# EAGLE design B-4-carte (EAGLE 9.6.2)
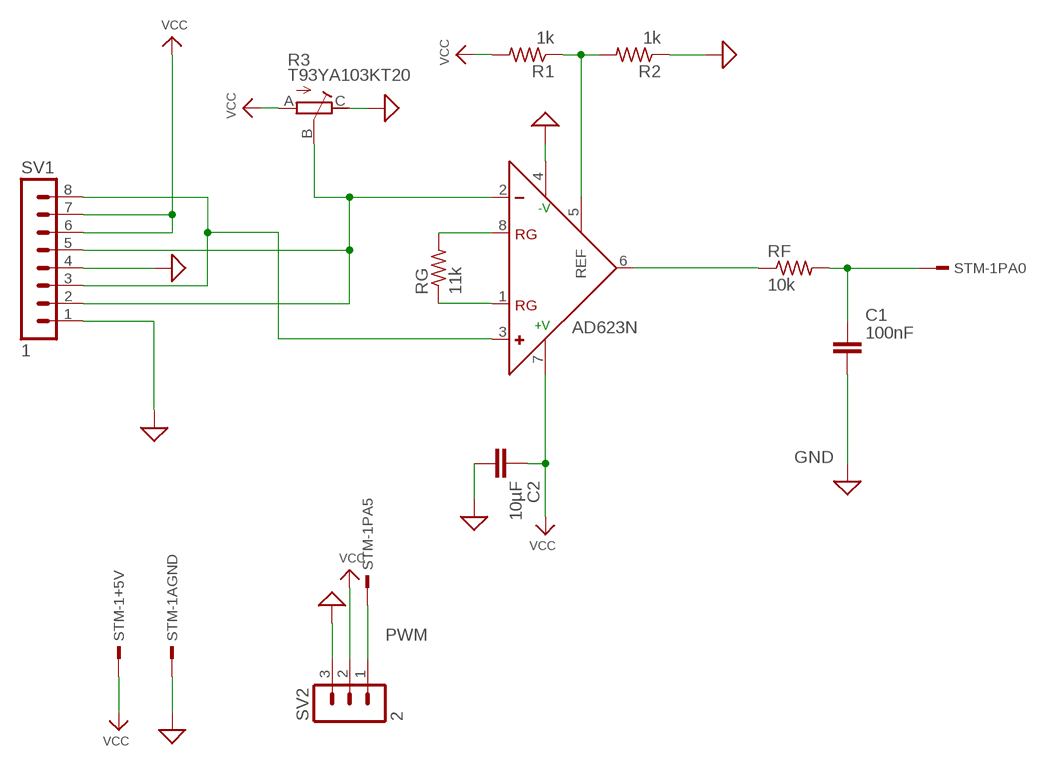
[diagram p0: schematic, sheet 1]

## Parts
C1  100nF  C2.5/2  [C2.5-2]
C2  10µF  C2.5/2  [C2.5-2]
IC1  AD623N  [DIL08]
R1  1k  R-US_0204/7  [0204/7]
R2  1k  R-US_0204/7  [0204/7]
R3  T93YA103KT20  [TRIM_T93YA103KT20]
RF  10k  R-US_0204/7  [0204/7]
RG  11k  R-US_0204/7  [0204/7]
STM-1  NUCLEO-F411RE  [CONN_STM32_NUCLEO]
SV1  1  MA08-1  [MA08-1]
SV2  2  MA03-1  [MA03-1]

## Nets
GND: C1.2 C2.2 IC1.4(-V) R2.1 R3.C STM-1.70 SV1.1 SV1.4 SV2.3 ; supply symbol labelled SUP
N$1: IC1.3(+) SV1.3 SV1.8
N$2: C1.1 RF.2 STM-1.28
N$3: IC1.2(-) R3.B SV1.2 SV1.5
N$6: IC1.1(RG) RG.1
N$7: IC1.8(RG) RG.2
N$10: IC1.5(REF) R1.1 R2.2
N$11: IC1.6(OUT) RF.1
PWM: STM-1.49 SV2.1
VCC: C2.1 IC1.7(+V) R1.2 R3.A STM-1.18 SV1.6 SV1.7 SV2.2
Unconnected: STM-1.1 STM-1.2 STM-1.3 STM-1.4 STM-1.5 STM-1.6 STM-1.7 STM-1.8 STM-1.9 STM-1.10 STM-1.11 STM-1.12 STM-1.13 STM-1.14 STM-1.15 STM-1.16 STM-1.17 STM-1.19 STM-1.20 STM-1.21 STM-1.22 STM-1.23 STM-1.24 STM-1.25 STM-1.26 STM-1.27 STM-1.29 STM-1.30 STM-1.31 STM-1.32 STM-1.33 STM-1.34 STM-1.35 STM-1.36 STM-1.37 STM-1.38 STM-1.39 STM-1.40 STM-1.41 STM-1.42 STM-1.43 STM-1.44 STM-1.45 STM-1.46 STM-1.47 STM-1.48 STM-1.50 STM-1.51 STM-1.52 STM-1.53 STM-1.54 STM-1.55 STM-1.56 STM-1.57 STM-1.58 STM-1.59 STM-1.60 STM-1.61 STM-1.62 STM-1.63 STM-1.64 STM-1.65 STM-1.66 STM-1.67 STM-1.68 STM-1.69 STM-1.71 STM-1.72 STM-1.73 STM-1.74 STM-1.75 STM-1.76

## Library data of the parts
C1 C2 = capacitor-wima:C: CAPACITOR naming: grid - package width
IC1 = analog-devices:AD623: Single-Supply, Rail-to-Rail, Low Cost Instrumentation Amplifier Source: http://www.analog.com/static/imported-files/data_sheets/AD623.pdf; MF: ALTERA CORPORATION; MPN: AD623ANZ; OC_FARNELL: 9603700; OC_NEWARK: 59K4402
R1 RG = adafruit:R-US_: RESISTOR, American symbol
R2 RF = BeagleBone_Black_Wireless:R-US_: RESISTOR, American symbol
R3 = T93YA103KT20:T93YA103KT20: Check availability <https://pricing.snapeda.com/parts/T93YA103KT20/Vishay/view-part?ref=eda>; AVAILABILITY: In Stock; CHECK_PRICES: https://www.snapeda.com/parts/T93YA103KT20/Vishay+Sfernice/view-part/?ref=eda; DESCRIPTION: 10 kOhms 0.5W, 1/2W PC Pins Through Hole Trimmer Potentiometer Cermet 21.0 Turn Top Adjustment; MF: Vishay; MP: T93YA103KT20; PACKAGE: TSOP-32338 Vishay; PRICE: None; SNAPEDA_LINK: https://www.snapeda.com/parts/T93YA103KT20/Vishay+Sfernice/view-part/?ref=snap
STM-1 = prj-ips-jmb:NUCLEO-F411RE
SV1 = con-lstb:MA08-1: PIN HEADER; OC_FARNELL: unknown; OC_NEWARK: unknown
SV2 = con-lstb:MA03-1: PIN HEADER; OC_FARNELL: unknown; OC_NEWARK: unknown

## Board
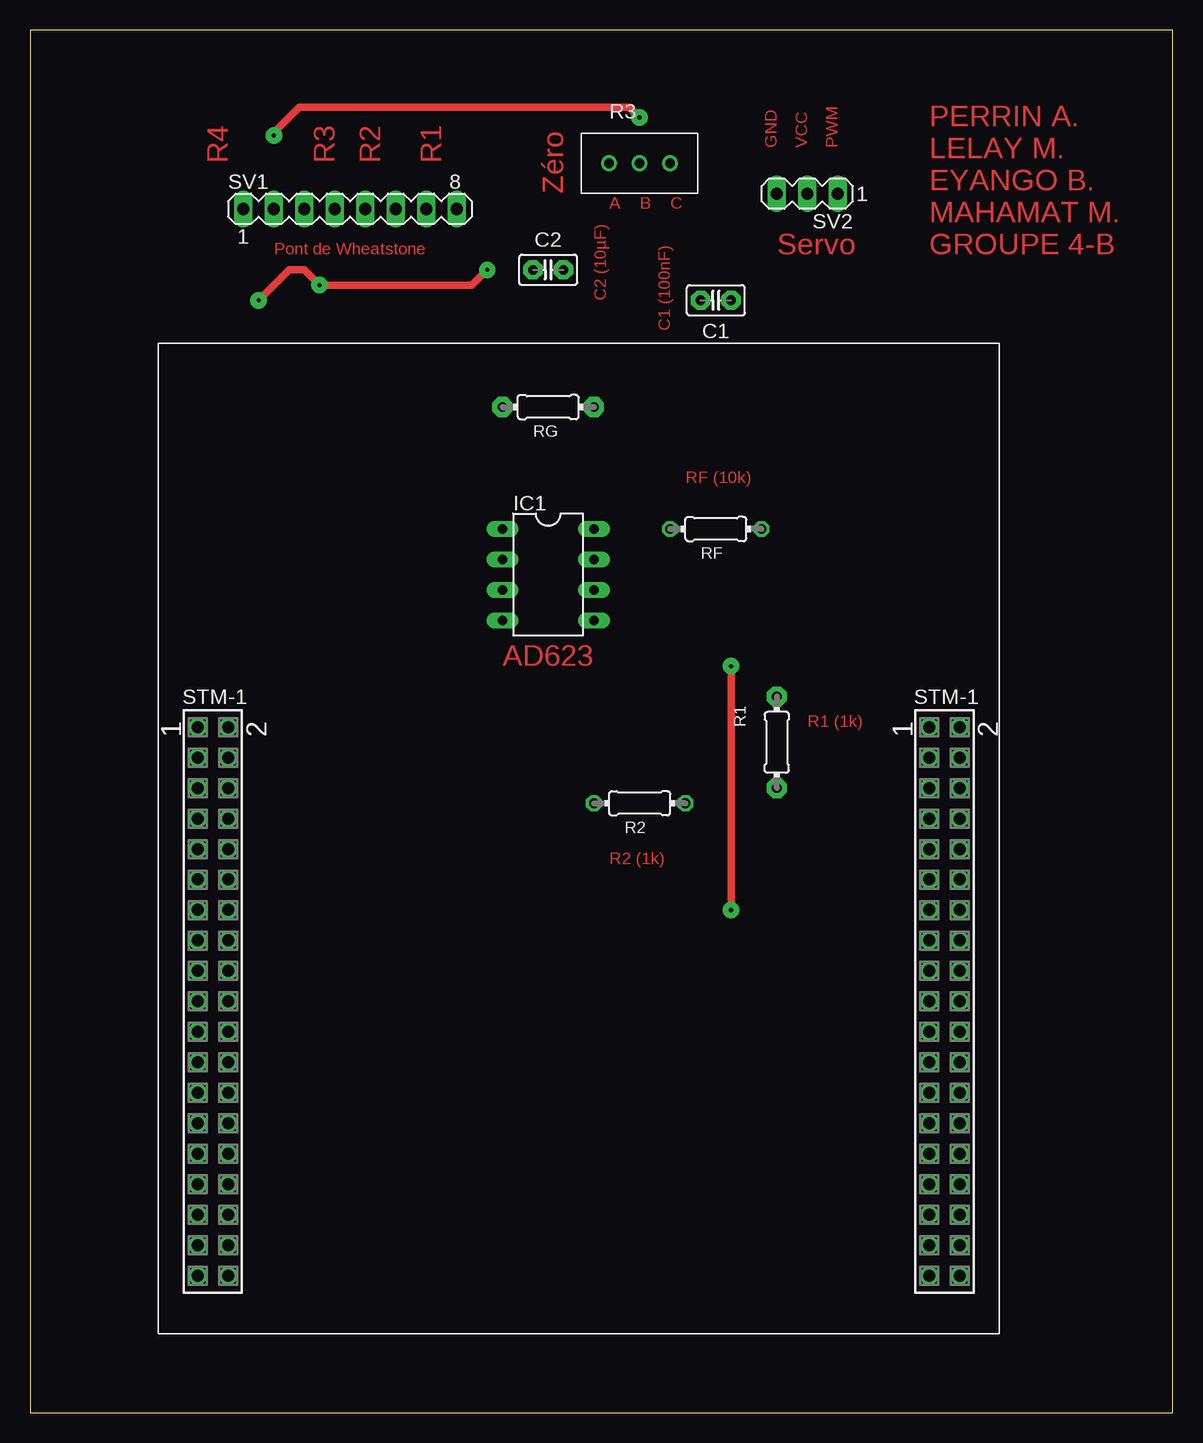
[diagram p1: board, top side]
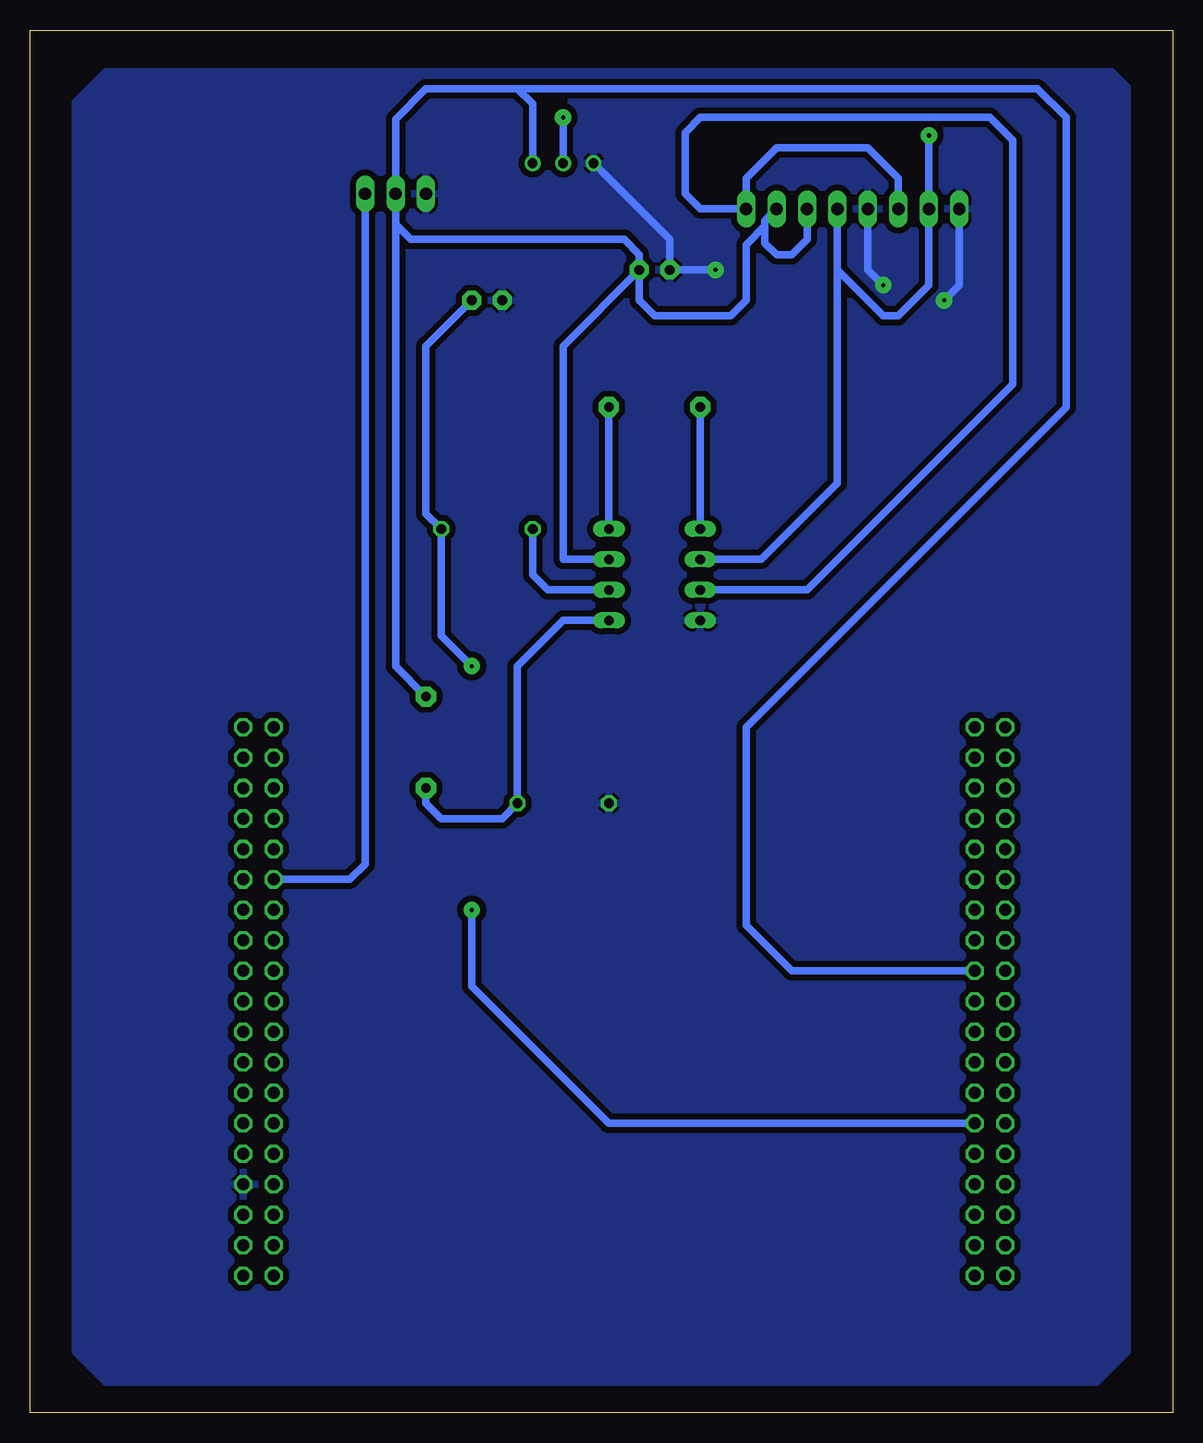
[diagram p2: board, bottom side, seen from below]

Size 95.23 x 115.24 mm. Coordinates in mm from the lower left corner, seen from the top.
Outline: 0,0 95.23,0 95.23,115.24 0,115.24 0,0
Copper layers (1*16): Top 0.035mm / dielectric 1.5mm / Bottom 0.035mm
Design rules "LBMS-ENIB": minimum track width 24mil, minimum drill 10mil, track to track 20mil, track to pad 20mil, pad to pad 20mil, via to via 20mil, smd to smd 8mil, copper to edge 80mil, drill to drill 8mil, minimum pad ring 10mil, minimum via ring 20mil, stop-mask expansion 4mil, vias tented up to drill 0mil, thermal gap 10mil

### Footprints (pad centres in the part's own frame; a part is rotated, then mirrored left to right if it is on the bottom)
C2.5-2 = drill 0.813 pad 1.6 octagon: 1 -1.27,0; 2 1.27,0
DIL08 = drill 0.813 long: 1 -3.81,-3.81; 2 -1.27,-3.81; 3 1.27,-3.81; 4 3.81,-3.81; 5 3.81,3.81; 6 1.27,3.81; 7 -1.27,3.81; 8 -3.81,3.81
0204/7 = drill 0.813 pad 1.676 octagon: 1 -3.81,0; 2 3.81,0
0204/7' = drill 0.813 octagon: 1 -3.81,0; 2 3.81,0
TRIM_T93YA103KT20 = drill 0.8: A 0,2.54; B 0,0; C 0,-2.54
CONN_STM32_NUCLEO = drill 1 pad 1.5 octagon: 1 -1.27,22.86; 2 1.27,22.86; 3 -1.27,20.32; 4 1.27,20.32; 5 -1.27,17.78; 6 1.27,17.78; 7 -1.27,15.24; 8 1.27,15.24; 9 -1.27,12.7; 10 1.27,12.7; 11 -1.27,10.16; 12 1.27,10.16; 13 -1.27,7.62; 14 1.27,7.62; 15 -1.27,5.08; 16 1.27,5.08; 17 -1.27,2.54; 18 1.27,2.54; 19 -1.27,0; 20 1.27,0; 21 -1.27,-2.54; 22 1.27,-2.54; 23 -1.27,-5.08; 24 1.27,-5.08; 25 -1.27,-7.62; 26 1.27,-7.62; 27 -1.27,-10.16; 28 1.27,-10.16; 29 -1.27,-12.7; 30 1.27,-12.7; 31 -1.27,-15.24; 32 1.27,-15.24; 33 -1.27,-17.78; 34 1.27,-17.78; 35 -1.27,-20.32; 36 1.27,-20.32; 37 -1.27,-22.86; 38 1.27,-22.86; 39 59.69,22.86; 40 62.23,22.86; 41 59.69,20.32; 42 62.23,20.32; 43 59.69,17.78; 44 62.23,17.78; 45 59.69,15.24; 46 62.23,15.24; 47 59.69,12.7; 48 62.23,12.7; 49 59.69,10.16; 50 62.23,10.16; 51 59.69,7.62; 52 62.23,7.62; 53 59.69,5.08; 54 62.23,5.08; 55 59.69,2.54; 56 62.23,2.54; 57 59.69,0; 58 62.23,0; 59 59.69,-2.54; 60 62.23,-2.54; 61 59.69,-5.08; 62 62.23,-5.08; 63 59.69,-7.62; 64 62.23,-7.62; 65 59.69,-10.16; 66 62.23,-10.16; 67 59.69,-12.7; 68 62.23,-12.7; 69 59.69,-15.24; 70 62.23,-15.24; 71 59.69,-17.78; 72 62.23,-17.78; 73 59.69,-20.32; 74 62.23,-20.32; 75 59.69,-22.86; 76 62.23,-22.86
MA08-1 = drill 1.016 long: 1 -8.89,0; 2 -6.35,0; 3 -3.81,0; 4 -1.27,0; 5 1.27,0; 6 3.81,0; 7 6.35,0; 8 8.89,0
MA03-1 = drill 1.016 long: 1 -2.54,0; 2 0,0; 3 2.54,0

### Placement (x,y rotation side)
C1  57.15,92.71 180 top
C2  43.18,95.25 180 top
IC1  43.18,69.85 270 top
R1  62.23,55.88 90 top
R2  1k  [0204/7']  50.8,50.8 0 top
R3  50.8,104.14 270 top
RF  10k  [0204/7']  57.15,73.66 0 top
RG  43.18,83.82 0 top
STM-1  15.24,34.29 0 top
SV1  26.67,100.33 0 top
SV2  64.77,101.6 180 top

### Tracks (layer width: path | path; a pad name or v marks a point on that pad's centre or on a via)
GND  (via drill 0.35)
  Top 0.61: v19.05,92.71 21.59,95.25 22.86,95.25 v24.13,93.98 36.83,93.98 v38.1,95.25
  Bottom 0.61: v38.1,95.25 C2.2 41.91,97.79 R3.C | SV1.1 17.78,93.98 v19.05,92.71 | v24.13,93.98 25.4,95.25 SV1.4
  pour Bottom: 5.08,111.76 88.9,111.76 91.44,109.22 91.44,5.08 88.9,2.54 6.35,2.54 3.81,5.08 3.81,110.49
N$1
  Bottom 0.61: SV1.3 22.86,102.87 25.4,105.41 33.02,105.41 35.56,102.87 SV1.8 39.37,100.33 40.64,101.6 40.64,106.68 39.37,107.95 15.24,107.95 13.34,106.05 13.34,85.73 30.48,68.58 IC1.3
N$2  (via drill 0.35)
  Top 0.61: v58.42,62.23 v58.42,41.91
  Bottom 0.61: C1.1 62.23,88.9 62.23,74.93 RF.2 60.96,64.77 v58.42,62.23 | STM-1.28 46.99,24.13 58.42,35.56 v58.42,41.91
N$3  (via drill 0.35)
  Top 0.61: v50.8,107.95 49.96,108.79 22.43,108.79 20.32,106.68 v20.32,106.45
  Bottom 0.61: IC1.2 34.29,71.12 27.94,77.47 SV1.5 27.94,95.25 24.13,91.44 22.86,91.44 20.32,93.98 SV1.2 v20.32,106.45 | R3.B v50.8,107.95
N$6
  Bottom 0.61: RG.1 IC1.1
N$7
  Bottom 0.61: RG.2 IC1.8
N$10
  Bottom 0.61: IC1.5 50.8,66.04 54.61,62.23 R2.2 55.88,49.53 60.96,49.53 62.23,50.8 R1.1
N$11
  Bottom 0.61: IC1.6 52.07,68.58 53.34,69.85 RF.1
PWM
  Bottom 0.61: SV2.1 67.31,45.72 68.58,44.45 STM-1.49
VCC
  Bottom 0.61: SV1.6 30.48,97.79 31.75,96.52 33.02,96.52 33.98,97.48 33.98,98.92 | SV1.7 33.98,99.37 33.98,98.92 | 33.98,98.92 35.56,97.34 35.56,92.71 36.83,91.44 43.18,91.44 44.45,92.71 C2.1 | SV2.2 64.77,99.06 63.5,97.79 45.72,97.79 44.45,96.52 C2.1 | R1.2 64.77,62.23 SV2.2 | SV2.2 64.77,107.82 62.23,110.36 54.61,110.36 | 54.61,110.36 11.3,110.36 8.89,107.95 8.89,83.82 35.56,57.15 35.56,40.64 31.75,36.83 STM-1.18 | IC1.7 50.8,71.12 50.8,88.9 C2.1 | R3.A 53.34,109.09 54.61,110.36

### Text on the board
Top: GND | VCC | PWM | R4 | R3 | R2 | R1 | Zéro | A | B | C | C2 (10µF) | Pont de Wheatstone | Servo | PERRIN A. / LELAY M. / EYANGO B. / MAHAMAT M. / GROUPE 4-B | C1 (100nF) | RF (10k) | AD623 | R1 (1k) | R2 (1k)